# EasyEDA schematic SCH_pi-tinker-hat_2025-06-06.json
TITLE: SCHEM_pi-tinker-hat; REV: 1.0; Date: 2025-05-17; Sheet: 1/1; Drawn By: krunchiekrunch; Company: krunchiekrunch
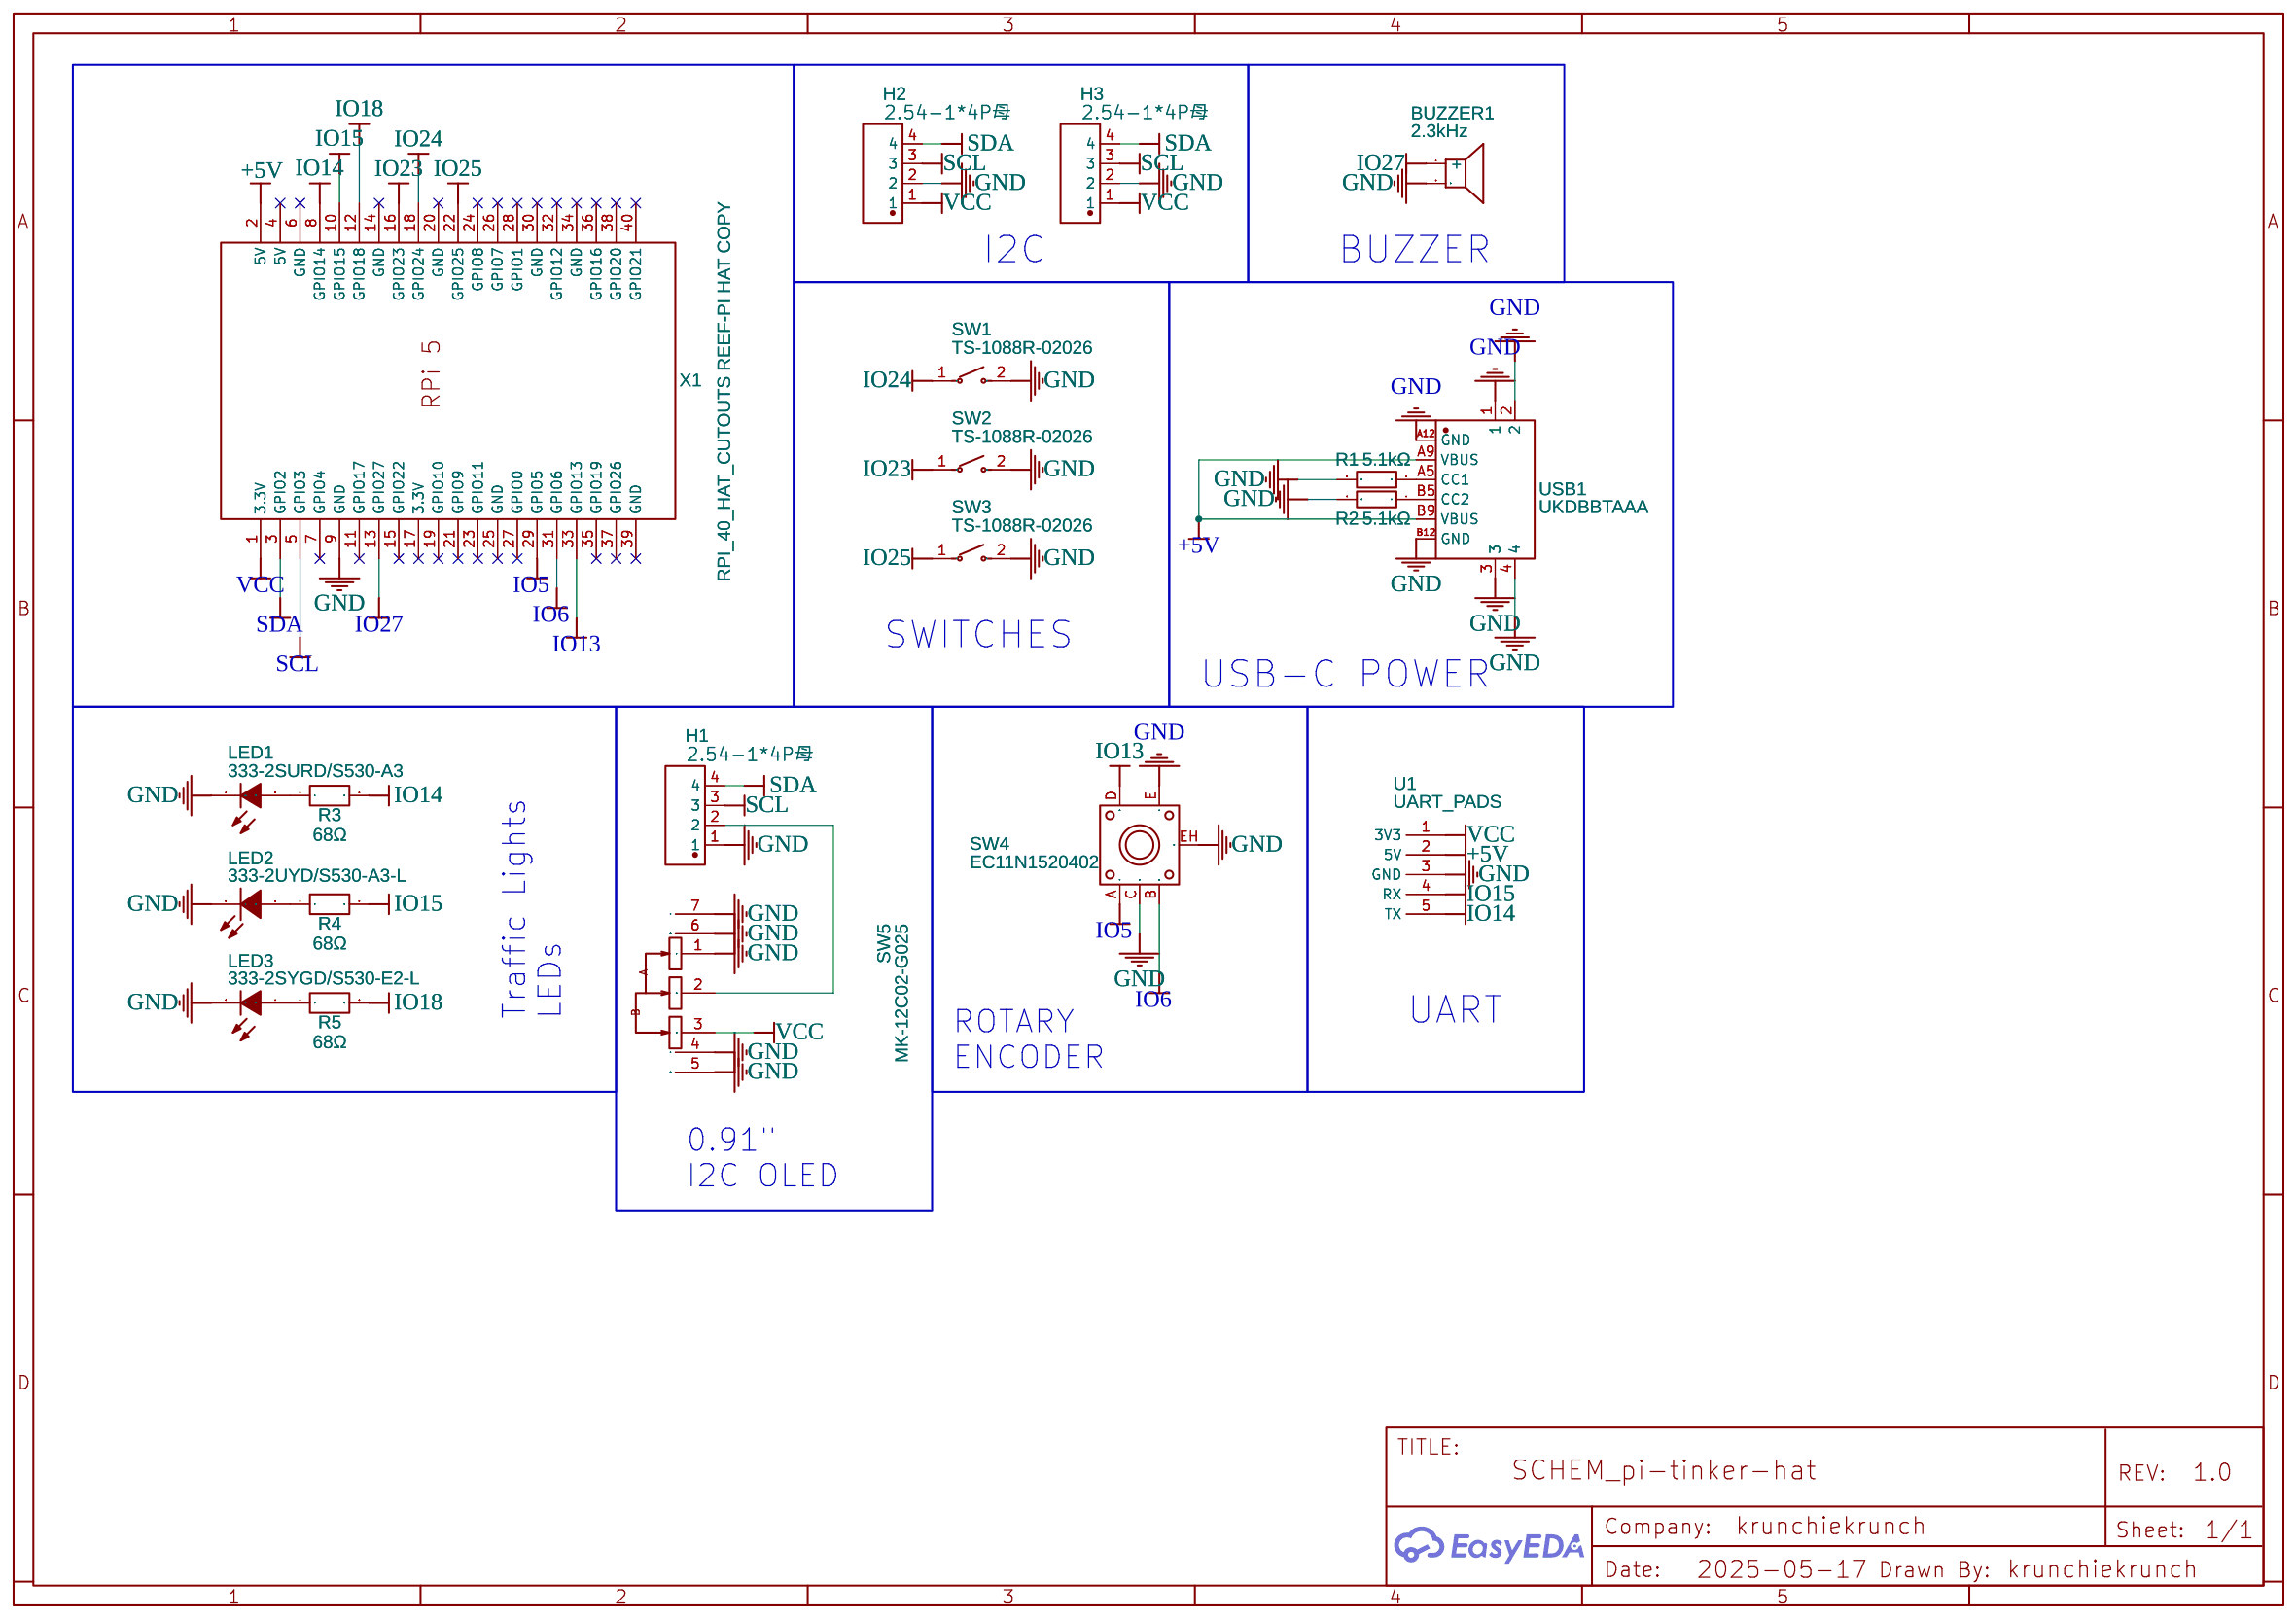
[diagram p0: schematic sheet]

## Parts
BUZZER1  2.3kHz  [BUZ-TH_BD12.0-P7.60-D0.6-FD]
H1  2.54-1*4P母  [HDR-TH_4P-P2.54-V-F]
H2  2.54-1*4P母  [HDR-TH_4P-P2.54-V-F]
H3  2.54-1*4P母  [HDR-TH_4P-P2.54-V-F]
LED1  333-2SURD/S530-A3  [LED-TH_BD5.9-P2.54-RD_RED]
LED2  333-2UYD/S530-A3-L  [LED-TH_BD5.0-P2.54-FD]
LED3  333-2SYGD/S530-E2-L  [LED-TH_BD5.0-P2.54-FD]
R1  5.1kΩ  [R0805]
R2  5.1kΩ  [R0805]
R3  68Ω  [R0805]
R4  68Ω  [R0805]
R5  68Ω  [R0805]
SW1  TS-1088R-02026  [SW-SMD_L3.9-W3.0-P4.45]
SW2  TS-1088R-02026  [SW-SMD_L3.9-W3.0-P4.45]
SW3  TS-1088R-02026  [SW-SMD_L3.9-W3.0-P4.45]
SW4  EC11N1520402  [SW-TH_EC11NXXXX]
SW5  MK-12C02-G025  [SW-SMD_MK-12C02-G025]
U1  UART_PADS  [UART_PADS]
USB1  UKDBBTAAA  [USB-C-SMD]
X1  RPI_40_HAT_CUTOUTS REEF-PI HAT COPY  [RPI_40_HAT_CUTOUTS REEF-PI HAT COPY]

## Library data of the parts
BUZZER1 = TMB12A05: Supplier: LCSC; Manufacturer: 华能; Supplier Part: C96093; JLCPCB Part Class: Extended Part
H1-H3 = 2.54-1*4P母: Contributor: LCSC; Supplier: LCSC; Supplier Part: C2718488; Manufacturer: BOOMELE(博穆精密); JLCPCB Part Class: Extended Part
LED1 = 333-2SURD/S530-A3: Supplier: LCSC; Manufacturer: EVERLIGHT(亿光); Supplier Part: C87271; JLCPCB Part Class: Extended Part
LED2 = 333-2UYD/S530-A3-L: Contributor: LCSC; Supplier: LCSC; Supplier Part: C88602; Manufacturer: EVERLIGHT(亿光); JLCPCB Part Class: Extended Part
LED3 = 333-2SYGD/S530-E2-L: Supplier: LCSC; Manufacturer: EVERLIGHT(亿光); Supplier Part: C99697; JLCPCB Part Class: Extended Part
R1 R2 = AECR0805F5K10K9: Contributor: LCSC; Supplier: LCSC; Supplier Part: C328405; Manufacturer: RESI(开步睿思); JLCPCB Part Class: Extended Part
R3-R5 = FRC0805J680 TS: Supplier: LCSC; Supplier Part: C2907341; Manufacturer: FOJAN(富捷); JLCPCB Part Class: Extended Part; Contributor: lcsc
SW1-SW3 = TS-1088R-02026: Contributor: LCSC; Supplier: LCSC; Supplier Part: C455280; Manufacturer: XUNPU(讯普); JLCPCB Part Class: Extended Part
SW4 = EC11N1520402: Contributor: LCSC; Supplier: LCSC; Supplier Part: C470704; Manufacturer: ALPSALPINE(阿尔卑斯阿尔派); JLCPCB Part Class: Extended Part
SW5 = MK-12C02-G025: Contributor: LCSC; Supplier: LCSC; Supplier Part: C778186; Manufacturer: G-Switch(品赞); JLCPCB Part Class: Extended Part
U1 = UART_PADS: Contributor: bastian.kolb
USB1 = UKDBBTAAA: Supplier: LCSC; Supplier Part: C29780875; Manufacturer: SAMZO(三佐); JLCPCB Part Class: Extended Part; Contributor: lcsc
X1 = Raspberry Pi 5: Contributor: lav4; Manufacturer: Raspberry Pi 5 4GB

## Nets
+5V: U1.2(5V) USB1.A9(VBUS) USB1.B9(VBUS) X1.2(5V)
GND: BUZZER1.2 H1.1 H2.2 H3.2 LED1.1(C) LED2.2(K) LED3.2(K) R1.2 R2.2 SW1.2 SW2.2 SW3.2 SW4.C SW4.E SW4.EH SW5.1 SW5.4 SW5.5 SW5.6 SW5.7 U1.3(GND) USB1.1 USB1.2 USB1.3 USB1.4 USB1.A12(GND) USB1.B12(GND) X1.9(GND)
VCC: H2.1 H3.1 SW5.3 U1.1(3V3) X1.1(3.3V)
IO5: SW4.A X1.29(GPIO5)
IO6: SW4.B X1.31(GPIO6)
IO13: SW4.D X1.33(GPIO13)
IO14: R3.2 U1.5(TX) X1.8(GPIO14)
IO15: R4.2 U1.4(RX) X1.10(GPIO15)
IO18: R5.2 X1.12(GPIO18)
IO23: SW2.1 X1.16(GPIO23)
IO24: SW1.1 X1.18(GPIO24)
IO25: SW3.1 X1.22(GPIO25)
IO27: BUZZER1.1(+) X1.13(GPIO27)
SCL: H1.3 H2.3 H3.3 X1.5(GPIO3)
SDA: H1.4 H2.4 H3.4 X1.3(GPIO2)
Net-(H1-2): H1.2 SW5.2
Net-(LED1-2): LED1.2(A) R3.1
Net-(LED2-1): LED2.1(A) R4.1
Net-(LED3-1): LED3.1(A) R5.1
Net-(R1-1): R1.1 USB1.A5(CC1)
Net-(R2-1): R2.1 USB1.B5(CC2)

Not connected (* = marked no-connect by the designer): X1 4(5V)* 6(GND)* 7(GPIO4)* 11(GPIO17)* 14(GND)* 15(GPIO22)* 17(3.3V)* 19(GPIO10)* 20(GND)* 21(GPIO9)* 23(GPIO11)* 24(GPIO8)* 25(GND)* 26(GPIO7)* 27(GPIO0)* 28(GPIO1)* 30(GND)* 32(GPIO12)* 34(GND)* 35(GPIO19)* 36(GPIO16)* 37(GPIO26)* 38(GPIO20)* 39(GND)* 40(GPIO21)*

## Notes on the sheet
- I2C
- BUZZER
- SWITCHES
- USB-C POWER
- UART
- Traffic Lights
  LEDs
- ROTARY
  ENCODER
- 0.91"
  I2C OLED
